# EAGLE design 89c2051-st-ps2 (EAGLE 4.16)
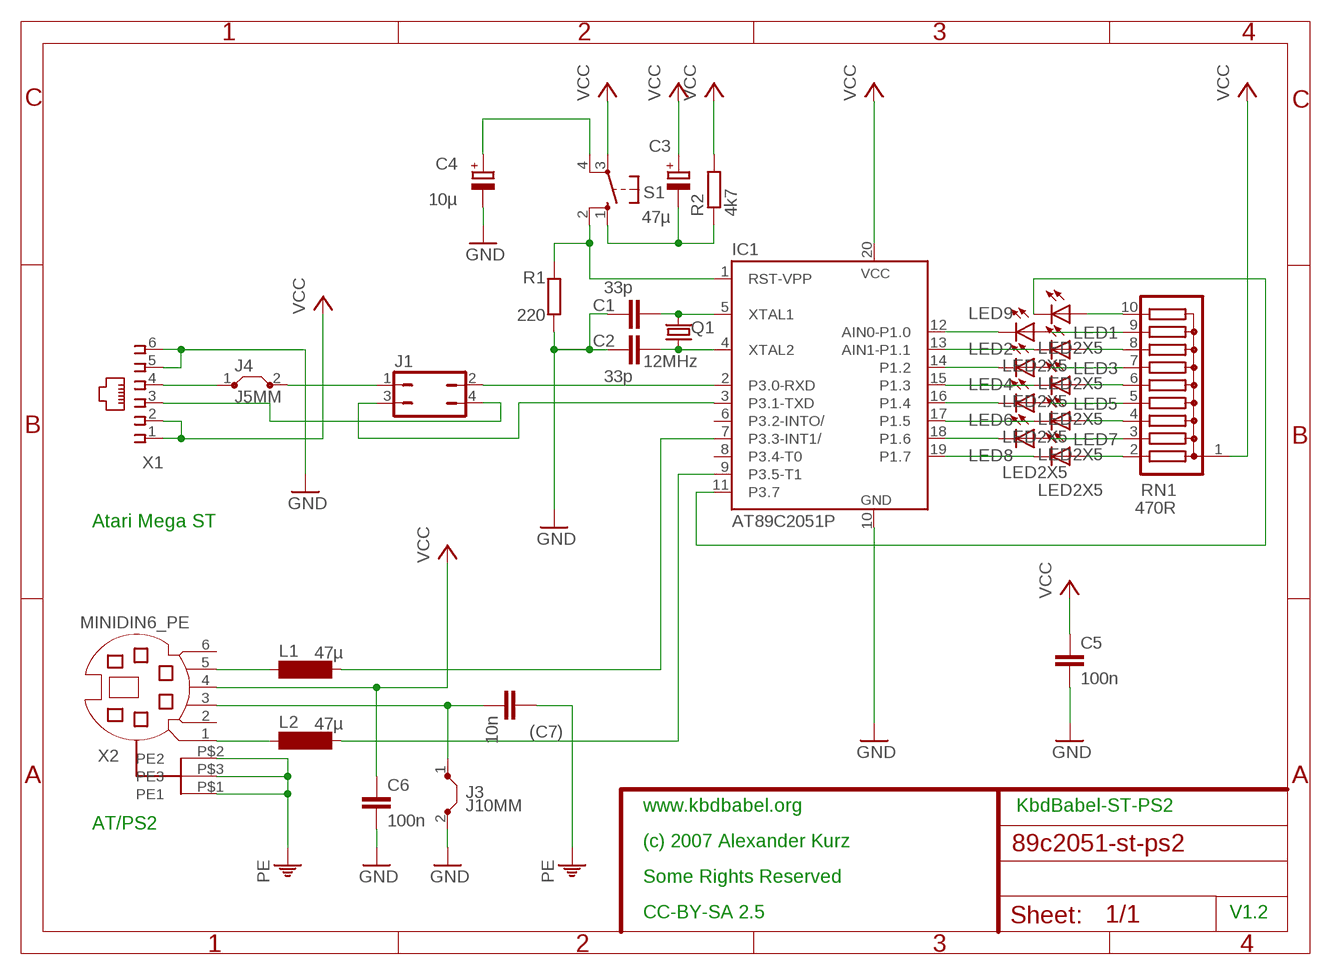
[diagram p0: schematic, sheet 1]

## Parts
(C7)  10n  C-EU025_050-025X075  [C025_050-025X075]
C1  33p  C-EU025-030X050  [C025-030X050]
C2  33p  C-EU025-030X050  [C025-030X050]
C3  47µ  CPOL-EUE2-5  [E2-5]
C4  10µ  CPOL-EUE2-5  [E2-5]
C5  100n  C-EU050-024X044  [C050-024X044]
C6  100n  C-EU025_050-025X075  [C025_050-025X075]
IC1  AT89C2051P  [DIL20]
J1  JP2Q  [JP2Q]
J3  J10MM  [10]
J4  J5MM  [05]
L1  47µ  SD75  [SD75]
L2  47µ  SD75  [SD75]
LED1  LED2X5  [LED2X5]
LED2  LED2X5  [LED2X5]
LED3  LED2X5  [LED2X5]
LED4  LED2X5  [LED2X5]
LED5  LED2X5  [LED2X5]
LED6  LED2X5  [LED2X5]
LED7  LED2X5  [LED2X5]
LED8  LED2X5  [LED2X5]
LED9  LED2X5  [LED2X5]
Q1  12MHz  CRYSTALHC49U70  [HC49U70]
R1  220  R-EU_0204/7  [0204/7]
R2  4k7  R-EU_0204/7  [0204/7]
RN1  470R  G09R  [SIL10]
S1  10-XX  [B3F-10XX]
X1  520250-3  [520250-3]
X2  MINIDIN6_PE  [MINIDIN6_PE]

## Nets
GND: C1.1 C2.2 C4.- C5.2 C6.2 IC1.10(GND) J3.2 R1.2 X1.5 X1.6
N$1: C1.2 IC1.5(XTAL1) Q1.2
N$2: C2.1 IC1.4(XTAL2) Q1.1
N$3: L1.1 X2.5
N$4: LED1.A RN1.9
N$5: IC1.17(P1.5) LED6.K(C)
N$6: IC1.2(P3.0-RXD) J1.2
N$7: (C7).2 J3.1 X2.3
N$8: IC1.12(AIN0-P1.0) LED1.K(C)
N$9: J1.1 J4.2
N$11: IC1.7(P3.3-INT1/) L1.2
N$12: IC1.9(P3.5-T1) L2.2
N$13: IC1.13(AIN1-P1.1) LED2.K(C)
N$14: LED3.A RN1.7
N$15: IC1.15(P1.3) LED4.K(C)
N$16: LED5.A RN1.5
N$17: LED2.A RN1.8
N$18: LED4.A RN1.6
N$19: LED6.A RN1.4
N$20: IC1.18(P1.6) LED7.K(C)
N$21: LED8.A RN1.2
N$22: LED7.A RN1.3
N$23: IC1.19(P1.7) LED8.K(C)
N$24: IC1.16(P1.4) LED5.K(C)
N$25: IC1.14(P1.2) LED3.K(C)
N$26: L2.1 X2.1
N$27: LED9.A RN1.10
N$28: IC1.11(P3.7) LED9.K(C)
N$29: J1.4 X1.3
N$30: IC1.1(RST-VPP) R1.1 S1.2(S1)
N$31: C3.- R2.1 S1.1(S)
N$32: IC1.3(P3.1-TXD) J1.3
N$33: J4.1 X1.4
N$34: C4.+ S1.4(P1)
PE: (C7).1 X2.P$1(PE1) X2.P$2(PE2) X2.P$3(PE3)
VCC: C3.+ C5.1 C6.1 IC1.20(VCC) R2.2 RN1.1 S1.3(P) X1.1 X1.2 X2.4
Unconnected: IC1.6(P3.2-INTO/) IC1.8(P3.4-T0) X2.2 X2.6

## Notes on the sheet
- Atari Mega ST
- www.kbdbabel.org | KbdBabel-ST-PS2
- AT/PS2
- (c) 2007 Alexander Kurz
- Some Rights Reserved
- CC-BY-SA 2.5 | V1.2

## Library data of the parts
(C7) C1 C2 C5 C6 = rcl:C-EU: CAPACITOR, European symbol
C3 C4 = rcl:CPOL-EU: POLARIZED CAPACITOR, European symbol
IC1 = atmel:AT89C2051: 80C31 MICROCONTROLLER 2 Kbytes FLASH 2.7 V
J1 = jumper:JP2Q: JUMPER
J3 J4 = jumper:J: Bridge
L1 L2 = inductor-neosid:SD75: INDUCTOR nominal inductance, E12
LED1-LED9 = bla:LED
Q1 = crystal:CRYSTAL: CRYSTAL
R1 R2 = rcl:R-EU_: RESISTOR, European symbol
RN1 = resistor-sil:G09R: SIL RESISTOR
S1 = switch-omron:10-XX: OMRON SWITCH
X1 = con-amp:520250-3: AMP connector
X2 = bla:MINIDIN6_PE

## Board
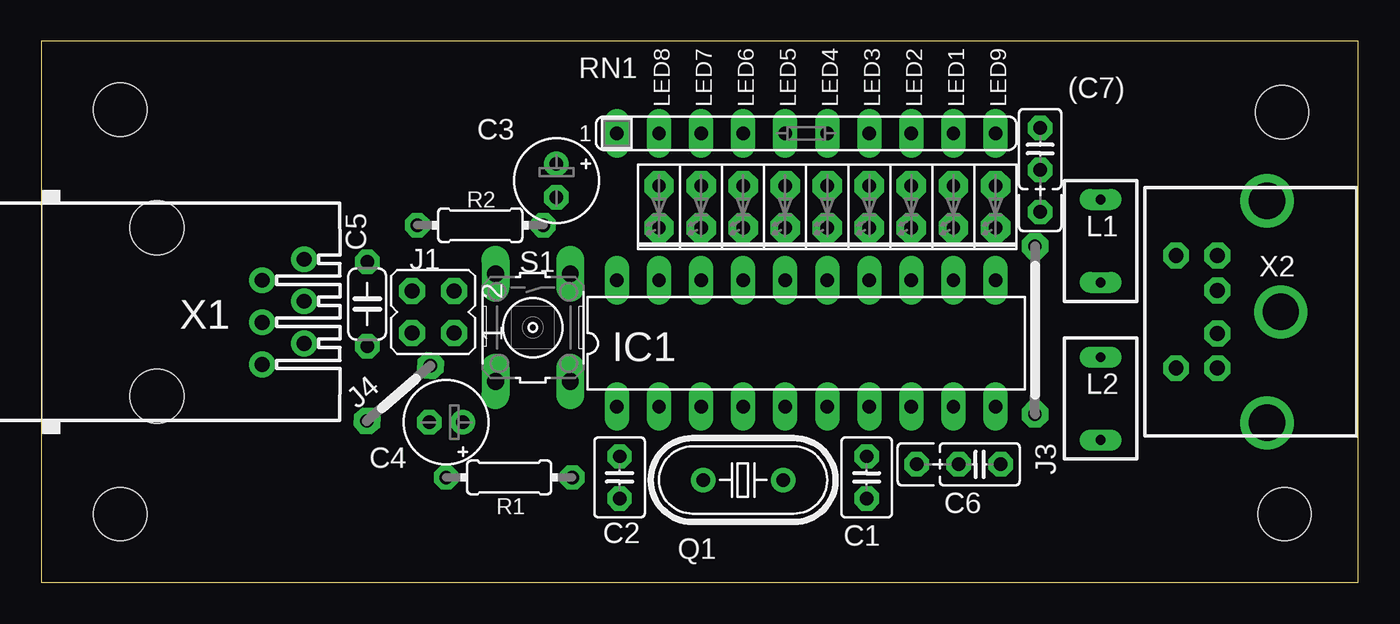
[diagram p1: board, top side]
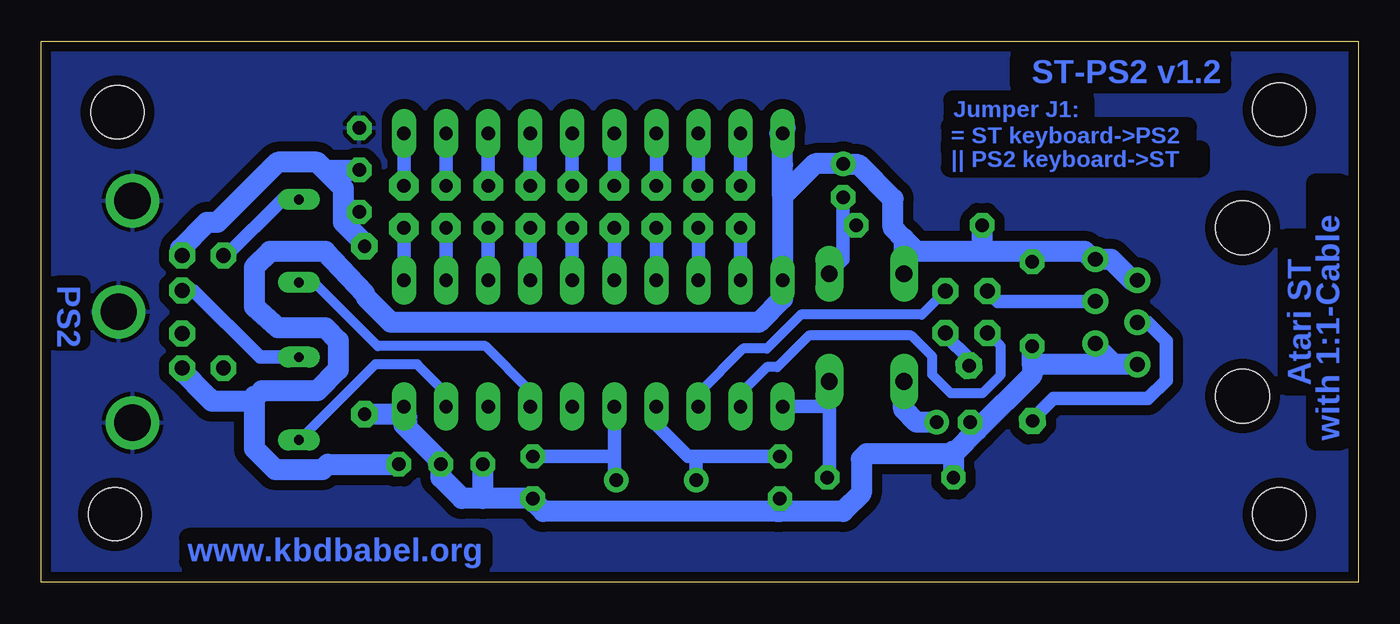
[diagram p2: board, bottom side, seen from below]

Size 79.52 x 32.69 mm. Coordinates in mm from the lower left corner, seen from the top.
Outline: 79.52,0 79.52,32.69 0,32.69 0,0 79.52,0
Copper layers (1*16): Top 0.035mm / dielectric 1.5mm / Bottom 0.035mm
Design rules "default": minimum track width 16mil, minimum drill 24mil, track to track 16mil, track to pad 16mil, pad to pad 16mil, via to via 16mil, smd to smd 16mil, copper to edge 20mil, drill to drill 8mil, minimum pad ring 13mil, minimum via ring 8mil, stop-mask expansion 4mil, vias tented up to drill 0mil, thermal gap 10mil
Holes 3.2 mm at 75.08,4.12 74.92,28.41 4.76,28.57 4.76,4.12

### Footprints (pad centres in the part's own frame; a part is rotated, then mirrored left to right if it is on the bottom)
C025_050-025X075 = drill 0.813 octagon: 1 -1.27,0; 2 1.27,0; 3 3.81,0
C025-030X050 = drill 0.813 octagon: 1 -1.27,0; 2 1.27,0
E2-5 = drill 0.813 pad 1.27 round: + -1.016,0 | drill 0.813 pad 1.27 octagon: - 1.016,0
C050-024X044 = drill 0.813 octagon: 1 -2.54,0; 2 2.54,0
DIL20 = drill 0.813 long: 1 -11.43,-3.81; 2 -8.89,-3.81; 3 -6.35,-3.81; 4 -3.81,-3.81; 5 -1.27,-3.81; 6 1.27,-3.81; 7 3.81,-3.81; 8 6.35,-3.81; 9 8.89,-3.81; 10 11.43,-3.81; 11 11.43,3.81; 12 8.89,3.81; 13 6.35,3.81; 14 3.81,3.81; 15 1.27,3.81; 16 -1.27,3.81; 17 -3.81,3.81; 18 -6.35,3.81; 19 -8.89,3.81; 20 -11.43,3.81
JP2Q = drill 0.914 octagon: 1 -1.27,-1.27; 2 -1.27,1.27; 3 1.27,-1.27; 4 1.27,1.27
10 = drill 0.813 pad 1.6 octagon: 1 -5.08,0; 2 5.08,0
05 = drill 0.813 pad 1.6 octagon: 1 -2.54,0; 2 2.54,0
SD75 = drill 0.6 long: 1 -2.5,0; 2 2.5,0
LED2X5 = drill 0.813 pad 1.778 octagon: A -1.27,0; K 1.27,0
HC49U70 = drill 0.813 round: 1 -2.413,0; 2 2.413,0
0204/7 = drill 0.813 octagon: 1 -3.81,0; 2 3.81,0
SIL10 = drill 0.813 long: 1 -11.43,0; 2 -8.89,0; 3 -6.35,0; 4 -3.81,0; 5 -1.27,0; 6 1.27,0; 7 3.81,0; 8 6.35,0; 9 8.89,0; 10 11.43,0
B3F-10XX = drill 1.016 long: 1 -3.251,2.261; 2 3.251,2.261; 3 -3.251,-2.261; 4 3.251,-2.261
520250-3 = drill 0.889 round: 1 -3.175,8.89; 2 -1.905,6.35; 3 -0.635,8.89; 4 0.635,6.35; 5 1.905,8.89; 6 3.175,6.35 | hole 3.251: -5.08,0; 5.08,0
MINIDIN6_PE = drill 0.9 octagon: 1 1.3,2.15; 2 -1.3,2.15; 3 3.4,2.15; 4 -3.4,2.15; 5 3.4,4.65; 6 -3.4,4.65 | drill 2.2 round: P$1 0,-1.676; P$2 -6.706,-0.838; P$3 6.706,-0.838

### Placement (x,y rotation side)
(C7)  60.32,26.19 270 top
C1  49.84,6.34 90 top
C2  34.92,6.34 270 top
C3  31.11,24.28 270 top
C4  24.44,9.68 180 top
C5  19.68,16.82 270 top
C6  56.67,7.14 180 top
IC1  46.19,14.44 0 top
J1  23.65,16.34 90 top
J3  60,15.23 270 top
J4  21.58,11.42 41 top
L1  63.97,20.63 270 top
L2  63.97,11.11 270 top
LED1  55.08,22.7 270 top
LED2  52.54,22.7 270 top
LED3  50,22.7 270 top
LED4  47.46,22.7 270 top
LED5  44.92,22.7 270 top
LED6  42.38,22.7 270 top
LED7  39.84,22.7 270 top
LED8  37.3,22.7 270 top
LED9  57.62,22.7 270 top
Q1  42.38,6.19 0 top
R1  28.25,6.34 180 top
R2  26.51,21.58 180 top
RN1  46.19,27.14 0 top
S1  29.68,15.39 270 top
X1  6.98,16.35 270 top
X2  73.18,16.34 90 top

### Tracks (layer width: path | path; a pad name or v marks a point on that pad's centre or on a via)
GND
  Bottom 1.27: 57.62,9.68 57.62,9.52 55.4,7.3 C6.2 | 57.62,9.68 57.62,9.99 | 57.62,9.99 IC1.10 | C6.2 | 50,5.07 C1.1 | 35.08,4.28 34.92,4.28 | 35.08,4.28 49.21,4.28 50,5.07 | 34.92,4.28 C2.2 | 34.92,4.28 | X1.5 16.03,14.44 14.76,13.17 | X1.6 14.76,13.17 | 35.08,4.28 31.11,4.28 30,5.39 30,7.45 29.68,7.77 24.44,7.77 | 19.68,12.53 | 19.68,12.53 23.01,9.2 | 23.01,9.2 24.36,7.85 | C4.- 23.43,9.61 23.01,9.2 | 24.36,7.85 24.44,7.93 24.44,7.77 | 24.36,7.85 | 24.44,7.77 R1.2 | 57.62,9.68 57.46,9.68 | 57.46,9.68 | 19.68,13.17 19.68,12.53 | 19.68,13.17 | 14.76,13.17 19.68,13.17 | C5.2 | C5.2 | 19.68,13.17 C5.2 | C5.2 | 50,5.07 52.86,5.07 | 52.86,5.07 54.13,5.07 55.4,6.34 55.4,6.98 55.56,7.14 | 55.56,7.14 | 55.56,7.14 C6.2 | 52.86,5.07 52.86,7.14 | 57.62,9.68 | 57.62,9.68 | 57.62,9.99 57.46,9.99 57.62,10.15 J3.2
N$1
  Bottom 0.813: 44.76,6.18 | Q1.2 44.76,6.18 | 44.92,7.61 44.92,6.34 44.76,6.18 | 44.92,7.61 IC1.5 | 44.92,7.61 | 44.92,7.61 C1.2
N$2
  Bottom 0.813: C2.1 40,7.61 | 40,7.61 40.48,7.61 42.38,9.52 42.38,10.79 | 42.38,10.79 | 42.38,10.79 IC1.4 | Q1.1 40,6.18 40,7.61
N$3
  Bottom 0.813: X2.5 68.48,19.74 68.42,19.68 64.96,23.13 L1.1
N$4
  Bottom 0.813: LED1.A RN1.9 | LED1.A
N$5
  Bottom 0.813: IC1.17 | IC1.17 LED6.K
N$6
  Bottom 0.61: J1.2 21.58,14.28 21.58,12.53 22.7,11.42 24.6,11.42 25.71,12.53 25.71,13.65 26.98,14.92 33.17,14.92 35.08,13.01 35.71,13.01 37.3,11.42 IC1.2 | IC1.2
N$7
  Bottom 1.27: X2.3 71.03,20.07 71.11,20.15 69.53,21.74 68.89,21.74 65.24,25.39 62.86,25.39 62.38,24.92 | 62.38,24.92 (C7).2 60.48,24.92 | 60.48,24.92 | J3.1 60,20.47 61.27,21.74 61.27,23.81 62.38,24.92
N$8
  Bottom 0.813: IC1.12 | IC1.12 LED1.K
N$9
  Bottom 0.813: J4.2 23.5,13.48 23.49,13.49 24.92,14.92 J1.1
N$11
  Bottom 0.61: IC1.7 50,11.58 52.7,14.28 59.21,14.28 63.18,18.25 63.81,18.25 63.97,18.09 64.01,18.13 L1.2
N$12
  Bottom 0.61: IC1.9 55.08,11.42 56.83,13.17 59.37,13.17 63.97,8.57 63.69,8.61 L2.2
N$13
  Bottom 0.813: LED2.K | IC1.13 LED2.K | LED2.K
N$14
  Bottom 0.813: LED3.A RN1.7 | LED3.A
N$15
  Bottom 0.813: IC1.15 | IC1.15 LED4.K | IC1.15
N$16
  Bottom 0.813: LED5.A RN1.5 | LED5.A
N$17
  Bottom 0.813: RN1.8 | LED2.A RN1.8
N$18
  Bottom 0.813: LED4.A RN1.6 | RN1.6
N$19
  Bottom 0.813: RN1.4 | LED6.A RN1.4
N$20
  Bottom 0.813: IC1.18 LED7.K | LED7.K
N$21
  Bottom 0.813: LED8.A RN1.2 | RN1.2
N$22
  Bottom 0.813: LED7.A 39.84,24.12 | 39.84,24.12 RN1.3 | 39.84,24.12
N$23
  Bottom 0.813: IC1.19 | IC1.19 LED8.K | IC1.19
N$24
  Bottom 0.813: IC1.16 LED5.K | LED5.K
N$25
  Bottom 0.813: IC1.14 | IC1.14 LED3.K
N$26
  Bottom 0.813: L2.1 66.31,13.61 70.32,17.61 70.96,17.61 70.99,17.64 X2.1
N$27
  Bottom 0.813: LED9.A RN1.10 | LED9.A
N$28
  Bottom 0.813: LED9.K 57.62,21.27 IC1.11
N$29
  Bottom 0.813: J1.4 | X1.3 21.74,16.98 J1.4
N$30
  Bottom 0.813: 31.94,10.79 31.94,6.46 R1.1 | 31.94,10.79 S1.2 | 31.94,10.79 31.9,10.79 32.06,10.63 IC1.1
N$31
  Bottom 0.813: S1.1 31.94,18.69 31.11,19.52 31.11,21.58 | 31.11,21.58 C3.- | 31.11,21.58 | R2.1 31.11,21.58 | 31.11,21.58
N$32
  Bottom 0.61: J1.3 | J1.3 26.35,16.19 33.65,16.19 35.71,14.12 37.14,14.12 39.84,11.42 IC1.3 | IC1.3
N$33
  Bottom 0.813: X1.4 12.69,15.71 11.58,14.6 11.58,12.22 12.69,11.11 18.41,11.11 19.76,9.76 | 19.76,9.76 19.84,9.68 | 19.76,9.76 J4.1
N$34
  Bottom 1.27: C4.+ 26.66,9.68 27.46,10.47 27.46,12.06 27.42,12.1 S1.4
PE
  pour Bottom (isolate 0.61): -0.16,-0.17 79.69,-0.17 79.69,32.85 -0.16,32.85
VCC
  Bottom 1.27: 34.76,20.31 IC1.20 34.76,18.09 | 34.76,23.33 34.76,20.31 | 34.76,23.33 34.76,24.6 | 34.76,24.6 34.76,25.23 | 34.76,25.23 RN1.1 34.92,27.14 | 58.41,15.71 | 34.76,24.6 | 34.76,20.31 | 34.76,25.23 | 34.92,27.14 | 34.92,27.14 34.6,27.46 | 58.41,15.71 36.19,15.71 34.76,17.14 34.76,18.09 | 34.76,18.09 | 34.76,23.33 | 34.76,23.33 32.79,25.3 C3.+ 31.11,25.23 | X1.2 13.65,18.25 14.92,19.52 X1.1 16.03,19.52 16.5,20 19.68,20 | C5.1 | C5.1 | 22.7,20 26.66,20 27.46,20.79 | 27.46,20.79 28.09,21.42 28.09,23.17 30.16,25.23 31.11,25.23 | 31.11,25.23 | 22.7,20 R2.2 | 22.7,20 | S1.3 27.42,20.75 27.46,20.79 | 19.68,20 22.7,20 | C5.1 19.68,20 | 66.59,11.21 66.19,11.58 62.86,11.58 61.59,12.85 61.59,14.6 62.38,15.39 65.24,15.39 66.67,16.66 66.67,19.04 65.72,20 62.38,20 60,17.46 59.84,17.14 58.41,15.71 | 66.59,11.21 66.67,11.11 | 58.41,15.71 | C6.1 62.22,7.14 62.54,6.82 65.4,6.82 66.67,8.09 66.67,10.95 | 66.59,11.21 66.61,11.21 66.67,11.26 66.67,10.95 | X2.4 71.03,12.77 69.53,11.26 | 69.53,11.26 | 69.37,11.11 69.53,11.26 | 69.37,11.11 | 69.37,11.11 69.21,10.95 66.67,10.95

### Text on the board
Bottom: ST-PS2 v1.2 | Jumper J1: | = ST keyboard->PS2 | || PS2 keyboard->ST | PS2 | Atari ST | with 1:1-Cable | www.kbdbabel.org